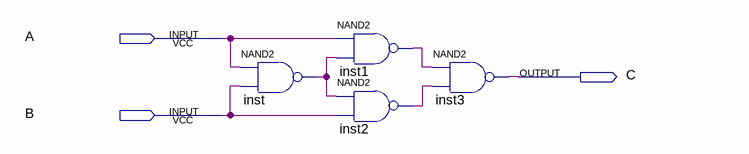
[diagram p0: schematic sheet]
// Quartus schematic xor_nand2.bdf as structural Verilog: 4 symbols, 3 pins
module xor_nand2 (
  input  A,
  input  B,
  output C
);

  wire inst1_out, inst2_out, inst_out;

  nand inst (inst_out, A, B);
  nand inst1 (inst1_out, A, inst_out);
  nand inst2 (inst2_out, inst_out, B);
  nand inst3 (C, inst1_out, inst2_out);
endmodule
